# EAGLE design PSPS_AVNC_SRD_power-2020-09-19 (EAGLE 9.6.2)
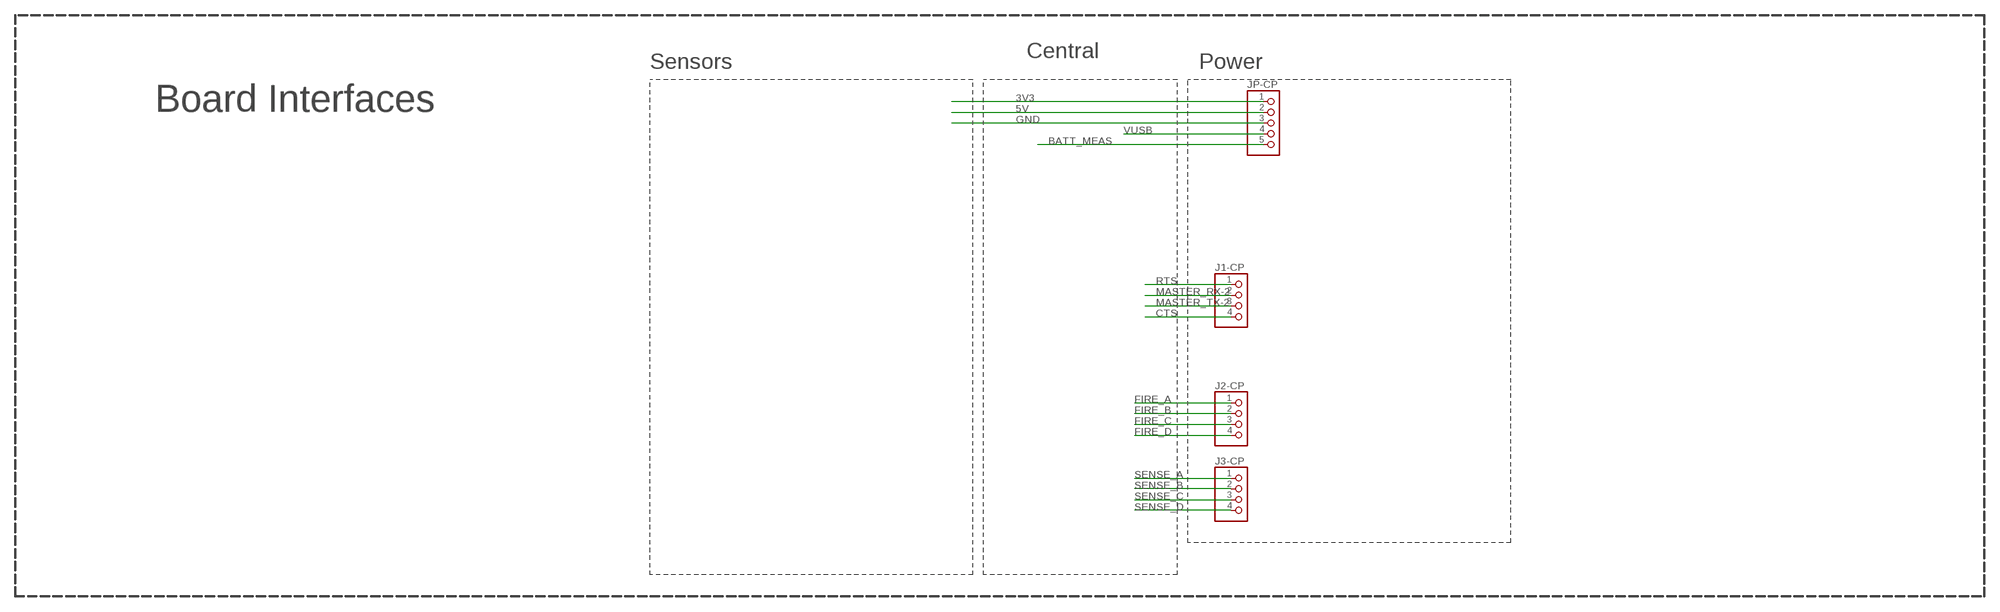
[diagram p0: schematic, sheet 1, part 1 of 3]
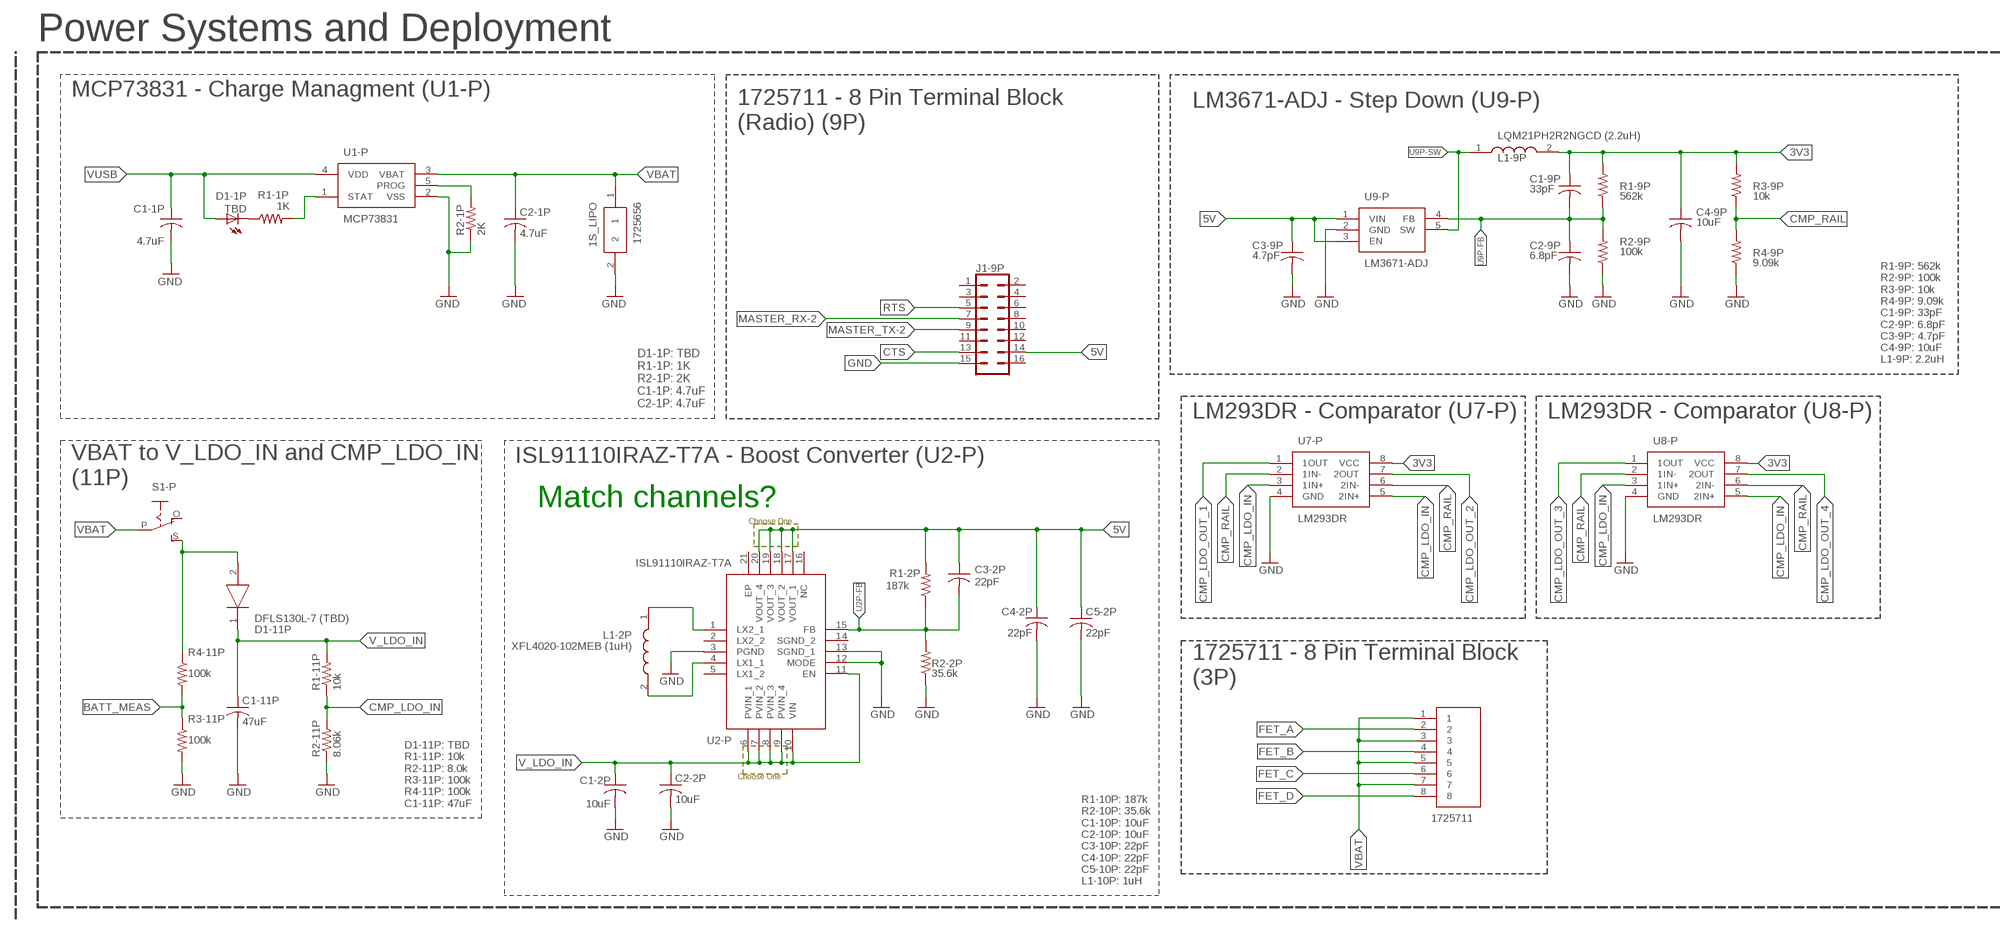
[diagram p1: schematic, sheet 1, part 2 of 3]
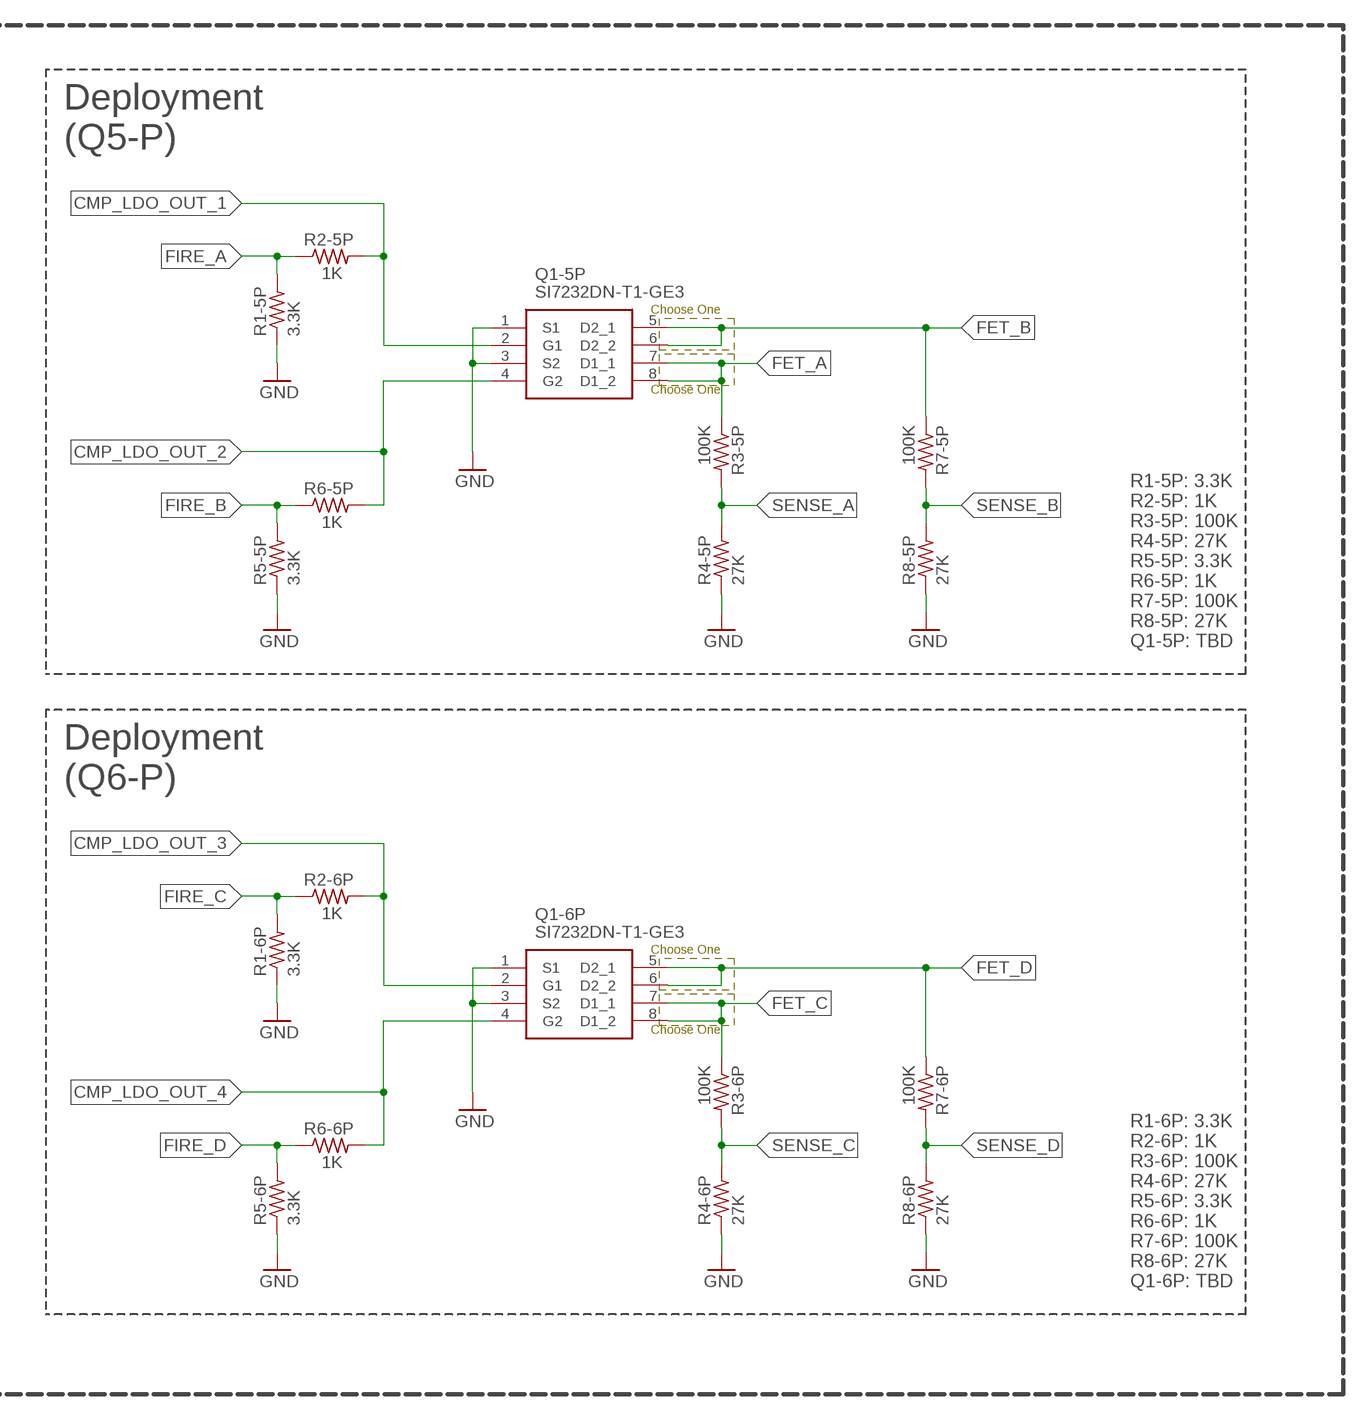
[diagram p2: schematic, sheet 1, part 3 of 3]

## Parts
1S_LIPO  1725656  [1725656]
C1-1P  4.7uF  C-USC0805  [C0805]
C1-2P  10uF  C-USC0805  [C0805]
C1-9P  33pF  C-USC0805  [C0805]
C1-11P  47uF  C-USC0805  [C0805]
C2-1P  4.7uF  C-USC0805  [C0805]
C2-2P  10uF  C-USC0805  [C0805]
C2-9P  6.8pF  C-USC0805  [C0805]
C3-2P  22pF  C-USC0805  [C0805]
C3-9P  4.7pF  C-USC0805  [C0805]
C4-2P  22pF  C-USC0805  [C0805]
C4-9P  10uF  C-USC0805  [C0805]
C5-2P  22pF  C-USC0805  [C0805]
D1-1P  TBD  LEDCHIPLED_0805  [CHIPLED_0805]
D1-11P  DFLS130L-7 (TBD)  DFLS130L-7  [POWERDI_123]
J1-9P  CONN_08X2  [2X8]
J1-CP  PINHD-1X4  [1X04]
J2-CP  PINHD-1X4  [1X04]
J2-P  1725711  [1725711]
J3-CP  PINHD-1X4  [1X04]
JP-CP  PINHD-1X5  [1X05]
L1-2P  XFL4020-102MEB (1uH)  XFL4020-102MEB  [XFL4020]
L1-9P  LQM21PH2R2NGCD (2.2uH)  LQM21PH2R2NGCD  [INDC2012X100N]
Q1-5P  SI7232DN-T1-GE3  [POWERPAK-1212-8]
Q1-6P  SI7232DN-T1-GE3  [POWERPAK-1212-8]
R1-1P  1K  R-US_R0805  [R0805]
R1-2P  187k  R-US_R0805  [R0805]
R1-5P  3.3K  R-US_M0805  [M0805]
R1-6P  3.3K  R-US_M0805  [M0805]
R1-9P  562k  R-US_R0805  [R0805]
R1-11P  10k  R-US_R0805  [R0805]
R2-1P  2K  R-US_R0805  [R0805]
R2-2P  35.6k  R-US_R0805  [R0805]
R2-5P  1K  R-US_M0805  [M0805]
R2-6P  1K  R-US_M0805  [M0805]
R2-9P  100k  R-US_R0805  [R0805]
R2-11P  8.06k  R-US_R0805  [R0805]
R3-5P  100K  R-US_M0805  [M0805]
R3-6P  100K  R-US_M0805  [M0805]
R3-9P  10k  R-US_R0805  [R0805]
R3-11P  100k  R-US_R0805  [R0805]
R4-5P  27K  R-US_M0805  [M0805]
R4-6P  27K  R-US_M0805  [M0805]
R4-9P  9.09k  R-US_R0805  [R0805]
R4-11P  100k  R-US_R0805  [R0805]
R5-5P  3.3K  R-US_M0805  [M0805]
R5-6P  3.3K  R-US_M0805  [M0805]
R6-5P  1K  R-US_M0805  [M0805]
R6-6P  1K  R-US_M0805  [M0805]
R7-5P  100K  R-US_M0805  [M0805]
R7-6P  100K  R-US_M0805  [M0805]
R8-5P  27K  R-US_M0805  [M0805]
R8-6P  27K  R-US_M0805  [M0805]
S1-P  EG1218S  [EG1218]
U1-P  MCP73831  MCP73831T-2ACI_OT  [SOT95P270X145-5N]
U2-P  ISL91110IRAZ-T7A  [QFN50P400X400X100-21N]
U7-P  LM293DR  [SOIC127P600X175-8N]
U8-P  LM293DR  [SOIC127P600X175-8N]
U9-P  LM3671-ADJ  LM3671MFX-ADJ_NOPB  [SOT95P280X145-5N]

## Nets
3V3: C1-9P.1 C4-9P.1 JP-CP.1 L1-9P.2 R1-9P.2 R3-9P.2 U7-P.8(VCC) U8-P.8(VCC)
5V: C3-2P.1 C3-9P.1 C4-2P.1 C5-2P.1 J1-9P.14 JP-CP.2 R1-2P.2 U2-P.17(VOUT_1) U2-P.18(VOUT_2) U2-P.19(VOUT_3) U2-P.20(VOUT_4) U9-P.1(VIN) U9-P.3(EN)
BATT_MEAS: JP-CP.5 R3-11P.1 R4-11P.2
CMP_LDO_IN: R1-11P.1 R2-11P.2 U7-P.3(1IN+) U7-P.5(2IN+) U8-P.3(1IN+) U8-P.5(2IN+)
CMP_LDO_OUT_1: Q1-5P.2(G1) R2-5P.2 U7-P.1(1OUT)
CMP_LDO_OUT_2: Q1-5P.4(G2) R6-5P.2 U7-P.7(2OUT)
CMP_LDO_OUT_3: Q1-6P.2(G1) R2-6P.2 U8-P.1(1OUT)
CMP_LDO_OUT_4: Q1-6P.4(G2) R6-6P.2 U8-P.7(2OUT)
CMP_RAIL: R3-9P.1 R4-9P.2 U7-P.2(1IN-) U7-P.6(2IN-) U8-P.2(1IN-) U8-P.6(2IN-)
CTS: J1-9P.13 J1-CP.4
D1-1P_R1-1P: D1-1P.C R1-1P.1
FET_A: J2-P.2 Q1-5P.7(D1_1) Q1-5P.8(D1_2) R3-5P.1
FET_B: J2-P.4 Q1-5P.5(D2_1) Q1-5P.6(D2_2) R7-5P.1
FET_C: J2-P.6 Q1-6P.7(D1_1) Q1-6P.8(D1_2) R3-6P.1
FET_D: J2-P.8 Q1-6P.5(D2_1) Q1-6P.6(D2_2) R7-6P.1
FIRE_A: J2-CP.1 R1-5P.2 R2-5P.1
FIRE_B: J2-CP.2 R5-5P.2 R6-5P.1
FIRE_C: J2-CP.3 R1-6P.2 R2-6P.1
FIRE_D: J2-CP.4 R5-6P.2 R6-6P.1
GND: 1S_LIPO.2 C1-1P.2 C1-2P.2 C1-11P.2 C2-1P.2 C2-2P.2 C2-9P.2 C3-9P.2 C4-2P.2 C4-9P.2 C5-2P.2 J1-9P.15 JP-CP.3 Q1-5P.1(S1) Q1-5P.3(S2) Q1-6P.1(S1) Q1-6P.3(S2) R1-5P.1 R1-6P.1 R2-1P.1 R2-2P.1 R2-9P.1 R2-11P.1 R3-11P.2 R4-5P.1 R4-6P.1 R4-9P.1 R5-5P.1 R5-6P.1 R8-5P.1 R8-6P.1 U1-P.2(VSS) U2-P.3(PGND) U2-P.12(MODE) U2-P.13(SGND_1) U7-P.4(GND) U8-P.4(GND) U9-P.2(GND)
MASTER_RX-2: J1-9P.7 J1-CP.2
MASTER_TX-2: J1-9P.9 J1-CP.3
RTS: J1-9P.5 J1-CP.1
SENSE_A: J3-CP.1 R3-5P.2 R4-5P.2
SENSE_B: J3-CP.2 R7-5P.2 R8-5P.2
SENSE_C: J3-CP.3 R3-6P.2 R4-6P.2
SENSE_D: J3-CP.4 R7-6P.2 R8-6P.2
U1P-PROG: R2-1P.2 U1-P.5(PROG)
U1P-STAT: R1-1P.2 U1-P.1(STAT)
U2P-FB: C3-2P.2 R1-2P.1 R2-2P.2 U2-P.15(FB)
U9P-FB: C1-9P.2 C2-9P.1 R1-9P.1 R2-9P.2 U9-P.4(FB)
U9P-LX1_1: L1-2P.2 U2-P.4(LX1_1)
U9P-LX2_1: L1-2P.1 U2-P.1(LX2_1)
U9P-SW: L1-9P.1 U9-P.5(SW)
V_LDO_IN: C1-2P.1 C1-11P.1 C2-2P.1 D1-11P.1(K) R1-11P.2 U2-P.6(PVIN_1) U2-P.7(PVIN_2) U2-P.8(PVIN_3) U2-P.9(PVIN_4) U2-P.10(VIN) U2-P.11(EN)
VBAT: 1S_LIPO.1 C2-1P.1 J2-P.1 J2-P.3 J2-P.5 J2-P.7 S1-P.P U1-P.3(VBAT)
VBAT_AFTER_SWITCH: D1-11P.2(A) R4-11P.1 S1-P.S
VUSB: C1-1P.1 D1-1P.A JP-CP.4 U1-P.4(VDD)
Unconnected: J1-9P.1 J1-9P.2 J1-9P.3 J1-9P.4 J1-9P.6 J1-9P.8 J1-9P.10 J1-9P.11 J1-9P.12 J1-9P.16 S1-P.O U2-P.2(LX2_2) U2-P.5(LX1_2) U2-P.14(SGND_2) U2-P.16(NC) U2-P.21(EP)

## Notes on the sheet
- Power Systems and Deployment
- MCP73831 - Charge Managment (U1-P)
- LM3671-ADJ - Step Down (U9-P)
- 1725711 - 8 Pin Terminal Block 
  (Radio) (9P)
- Deployment
  (Q5-P)
- Choose One
- Choose One
- R1-9P: 562k
  R2-9P: 100k
  R3-9P: 10k
  R4-9P: 9.09k
  C1-9P: 33pF
  C2-9P: 6.8pF
  C3-9P: 4.7pF
  C4-9P: 10uF
  L1-9P: 2.2uH
- D1-1P: TBD
  R1-1P: 1K
  R2-1P: 2K
  C1-1P: 4.7uF
  C2-1P: 4.7uF
- LM293DR - Comparator (U7-P) | LM293DR - Comparator (U8-P)
- R1-5P: 3.3K
  R2-5P: 1K
  R3-5P: 100K
  R4-5P: 27K
  R5-5P: 3.3K
  R6-5P: 1K
  R7-5P: 100K
  R8-5P: 27K
  Q1-5P: TBD
- ISL91110IRAZ-T7A - Boost Converter (U2-P)
- VBAT to V_LDO_IN and CMP_LDO_IN
  (11P)
- Match channels?
- Choose One
- Deployment
  (Q6-P)
- Choose One
- Choose One
- 1725711 - 8 Pin Terminal Block
  (3P)
- Choose One
- D1-11P: TBD
  R1-11P: 10k
  R2-11P: 8.0k
  R3-11P: 100k
  R4-11P: 100k
  C1-11P: 47uF
- R1-6P: 3.3K
  R2-6P: 1K
  R3-6P: 100K
  R4-6P: 27K
  R5-6P: 3.3K
  R6-6P: 1K
  R7-6P: 100K
  R8-6P: 27K
  Q1-6P: TBD
- R1-10P: 187k
  R2-10P: 35.6k
  C1-10P: 10uF
  C2-10P: 10uF
  C3-10P: 22pF
  C4-10P: 22pF
  C5-10P: 22pF
  L1-10P: 1uH
- Central
- Sensors | Power
- Board Interfaces

## Library data of the parts
1S_LIPO = SamacSys_Parts:1725656: 2 way PCB vertical mount terminal,2.54mm 2 way PCB vertical mount terminal,2.54mm Source: Datasheet <https://componentsearchengine.com/Datasheets/1/1725656.pdf>; DESCRIPTION: 2 way PCB vertical mount terminal,2.54mm 2 way PCB vertical mount terminal,2.54mm; HEIGHT: 8mm; MANUFACTURER_NAME: Phoenix Contact; MANUFACTURER_PART_NUMBER: 1725656; MOUSER_PART_NUMBER: 651-1725656; MOUSER_PRICE-STOCK: https://www.mouser.com/Search/Refine.aspx?Keyword=651-1725656
C1-1P C1-2P C1-9P C1-11P C2-1P C2-9P C3-2P C3-9P C4-9P = resistor:C-US: CAPACITOR, American symbol
C2-2P C5-2P = BeagleBone_Black_Wireless:C-US: CAPACITOR, American symbol
C4-2P = resistor:C-US: CAPACITOR, American symbol; SPICEPREFIX: C
D1-1P = adafruit:LED: LED OSRAM: - CHIPLED LG R971, LG N971, LY N971, LG Q971, LY Q971, LO R971, LY R971 LH N974, LH R974 LS Q976, LO Q976, LY Q976 LO Q996 - Hyper CHIPLED LW Q18S LB Q993, LB Q99A, LB R99A - SideLED LS A670, LO A670, LY A670, LG A670, LP A670 LB A673, LV A673, LT A673, LW A673 LH A674 LY A675 LS A676, LA A676, LO A676, LY A676, LW A676 LS A679, LY A679, LG A679 - Hyper Micro SIDELED® LS Y876, LA Y876, LO Y876, LY Y876 LT Y87S - SmartLED LW L88C, LW L88S LB L89C, LB L89S, LG L890 LS L89K, LO L89K, LY L89K LS L896, LA L896, LO L896, LY L896 - TOPLED LS T670, LO T670, LY T670, LG T670, LP T670 LSG T670, LSP T670, LSY T670, LOP T670, LYG T670 LG T671, LOG T671, LSG T671 LB T673, LV T673, LT T673, LW T673 LH T674 LS T676, LA T676, LO T676, LY T676, LB T676, LH T676, LSB T676, LW T676 LB T67C, LV T67C, LT T67C, LS T67K, LO T67K, LY T67K, LW E67C LS E67B, LA E67B, LO E67B, LY E67B, LB E67C, LV E67C, LT E67C LW T67C LS T679, LY T679, LG T679 LS T770, LO T770, LY T770, LG T770, LP T770 LB T773, LV T773, LT T773, LW T773 LH T774 LS E675, LA E675, LY E675, LS T675 LS T776, LA T776, LO T776, LY T776, LB T776 LHGB T686 LT T68C, LB T68C - Hyper Mini TOPLED® LB M676 - Mini TOPLED Santana® LG M470 LS M47K, LO M47K, LY M47K Source: http://www.osram.convergy.de/
D1-11P = SamacSys_Parts:DFLS130L-7: 1.0A SURFACE MOUNT SCHOTTKY BARRIER RECTIFIER Source: Datasheet <https://componentsearchengine.com/Datasheets/1/DFLS130L-7.pdf>; DESCRIPTION: 1.0A SURFACE MOUNT SCHOTTKY BARRIER RECTIFIER; HEIGHT: mm; MANUFACTURER_NAME: Diodes Inc.; MANUFACTURER_PART_NUMBER: DFLS130L-7; MOUSER_PART_NUMBER: 621-DFLS130L; MOUSER_PRICE-STOCK: https://www.mouser.com/Search/Refine.aspx?Keyword=621-DFLS130L
J1-9P = SparkFun-Connectors:CONN_08X2: Multi connection point. Often used as Generic Header-pin footprint for 0.1 inch spaced/style header connections You can populate with any combo of single row headers, but if you'd like an exact match, check this: Header - 2x8 (Male, 0.1") <https://www.sparkfun.com/products/13156> (PRT-13156) On any of the 0.1 inch spaced packages, you can populate with these: Break Away Headers - Straight <https://www.sparkfun.com/products/116> (PRT-00116) Break Away Male Headers - Right Angle <https://www.sparkfun.com/products/553> (PRT-00553) Female Headers <https://www.sparkfun.com/products/115> (PRT-00115) Break Away Headers - Machine Pin <https://www.sparkfun.com/products/117> (PRT-00117) Break Away Female Headers - Swiss Machine Pin <https://www.sparkfun.com/products/743> (PRT-00743)
J1-CP J2-CP J3-CP = pinhead:PINHD-1X4: PIN HEADER
J2-P = SamacSys_Parts:1725711: 8 way PCB vertical mount terminal,2.54mm 8 way PCB vertical mount terminal,2.54mm Source: Datasheet <https://componentsearchengine.com/Datasheets/1/1725711.pdf>; DESCRIPTION: 8 way PCB vertical mount terminal,2.54mm 8 way PCB vertical mount terminal,2.54mm; HEIGHT: mm; MANUFACTURER_NAME: Phoenix Contact; MANUFACTURER_PART_NUMBER: 1725711; MOUSER_PART_NUMBER: 651-1725711; MOUSER_PRICE-STOCK: https://www.mouser.com/Search/Refine.aspx?Keyword=651-1725711
JP-CP = pinhead:PINHD-1X5: PIN HEADER
L1-2P = SamacSys_Parts:XFL4020-102MEB: Fixed Inductors XFL4020 AEC-Q200 1 uH 20% 11 A Compos Source: Datasheet <https://componentsearchengine.com/Datasheets/1/XFL4020-102MEB.pdf>; DESCRIPTION: Fixed Inductors XFL4020 AEC-Q200 1 uH 20% 11 A Compos; HEIGHT: mm; MANUFACTURER_NAME: COILCRAFT; MANUFACTURER_PART_NUMBER: XFL4020-102MEB; MOUSER_PART_NUMBER: 994-XFL4020-102MEB; MOUSER_PRICE-STOCK: https://www.mouser.com/Search/Refine.aspx?Keyword=994-XFL4020-102MEB
L1-9P = SamacSys_Parts:LQM21PH2R2NGCD: LQM21PH_GC Series Inductor 2.2uH +/-30% 0805 (2012) Source: Datasheet <https://componentsearchengine.com/Datasheets/1/LQM21PH2R2NGCD.pdf>; DESCRIPTION: LQM21PH_GC Series Inductor 2.2uH +/-30% 0805 (2012); HEIGHT: 1mm; MANUFACTURER_NAME: Murata Electronics; MANUFACTURER_PART_NUMBER: LQM21PH2R2NGCD; MOUSER_PART_NUMBER: 81-LQM21PH2R2NGCD; MOUSER_PRICE-STOCK: https://www.mouser.com/Search/Refine.aspx?Keyword=81-LQM21PH2R2NGCD
Q1-5P Q1-6P = SamacSys_Parts:SI7232DN-T1-GE3: Trans MOSFET N-CH 20V 10An Vishay SI7232DN-T1-GE3 Dual N-channel MOSFET Transistor, 24 A, 20 V, 8-Pin PowerPAK 1212 Source: Datasheet <https://componentsearchengine.com/Datasheets/1/SI7232DN-T1-GE3.pdf>; DESCRIPTION: Trans MOSFET N-CH 20V 10An Vishay SI7232DN-T1-GE3 Dual N-channel MOSFET Transistor, 24 A, 20 V, 8-Pin PowerPAK 1212; HEIGHT: mm; MANUFACTURER_NAME: Vishay; MANUFACTURER_PART_NUMBER: SI7232DN-T1-GE3; MOUSER_PART_NUMBER: 781-SI7232DN-GE3; MOUSER_PRICE-STOCK: https://www.mouser.com/Search/Refine.aspx?Keyword=781-SI7232DN-GE3
R1-1P R1-2P R1-9P R1-11P R2-1P R2-2P R2-9P R2-11P R3-9P R4-9P = resistor:R-US_: RESISTOR, American symbol
R1-5P R1-6P R2-5P R2-6P R3-5P R3-6P R4-5P R4-6P R5-5P R5-6P R6-5P R6-6P R7-5P R7-6P R8-5P R8-6P = rcl:R-US_: RESISTOR, American symbol; SPICEPREFIX: R
R3-11P R4-11P = PulseOximeterECG_AU:R-US_: RESISTOR, American symbol; SPICEPREFIX: R
S1-P = adafruit:EG1218: SLIDING SWITCH 0.1" spacing through hole, vertical SPDT slide switch http://www.ladyada.net/library/pcb/eaglelibrary.html
U1-P = SamacSys_Parts:MCP73831T-2ACI_OT: Li-Ion Charge Controller 4.2V SOT23-5 Source: Datasheet <https://componentsearchengine.com/Datasheets/1/MCP73831T-2ACI_OT.pdf>; DESCRIPTION: Li-Ion Charge Controller 4.2V SOT23-5; HEIGHT: 1.45mm; MANUFACTURER_NAME: Microchip; MANUFACTURER_PART_NUMBER: MCP73831T-2ACI/OT; MOUSER_PART_NUMBER: 579-MCP73831T-2ACIOT; MOUSER_PRICE-STOCK: https://www.mouser.com/Search/Refine.aspx?Keyword=579-MCP73831T-2ACIOT
U2-P = SamacSys_Parts:ISL91110IRAZ-T7A: Integrated FET Regulators High Current Buck Boost Switching Regulator Delivering 2A of Continuous Output Current Source: Datasheet <https://www.renesas.com/en-us/www/doc/datasheet/isl91110ir.pdf>; DESCRIPTION: Integrated FET Regulators High Current Buck Boost Switching Regulator Delivering 2A of Continuous Output Current; HEIGHT: 1mm; MANUFACTURER_NAME: Renesas Electronics; MANUFACTURER_PART_NUMBER: ISL91110IRAZ-T7A
U7-P U8-P = SamacSys_Parts:LM293DR: Dual differential comparator, industrial grade Source: Datasheet <http://www.ti.com/lit/gpn/lm293>; DESCRIPTION: Dual differential comparator, industrial grade; HEIGHT: 1.75mm; MANUFACTURER_NAME: Texas Instruments; MANUFACTURER_PART_NUMBER: LM293DR; MOUSER_PART_NUMBER: 595-LM293DR; MOUSER_PRICE-STOCK: https://www.mouser.com/Search/Refine.aspx?Keyword=595-LM293DR
U9-P = SamacSys_Parts:LM3671MFX-ADJ_NOPB: 2MHz, 600mA Step-Down DC-DC Converter Source: Datasheet <http://www.ti.com/lit/gpn/lm3671>; DESCRIPTION: 2MHz, 600mA Step-Down DC-DC Converter; HEIGHT: 1.45mm; MANUFACTURER_NAME: Texas Instruments; MANUFACTURER_PART_NUMBER: LM3671MFX-ADJ/NOPB; MOUSER_PART_NUMBER: 926-LM3671MFXADJNOPB; MOUSER_PRICE-STOCK: https://www.mouser.com/Search/Refine.aspx?Keyword=926-LM3671MFXADJNOPB

## Board
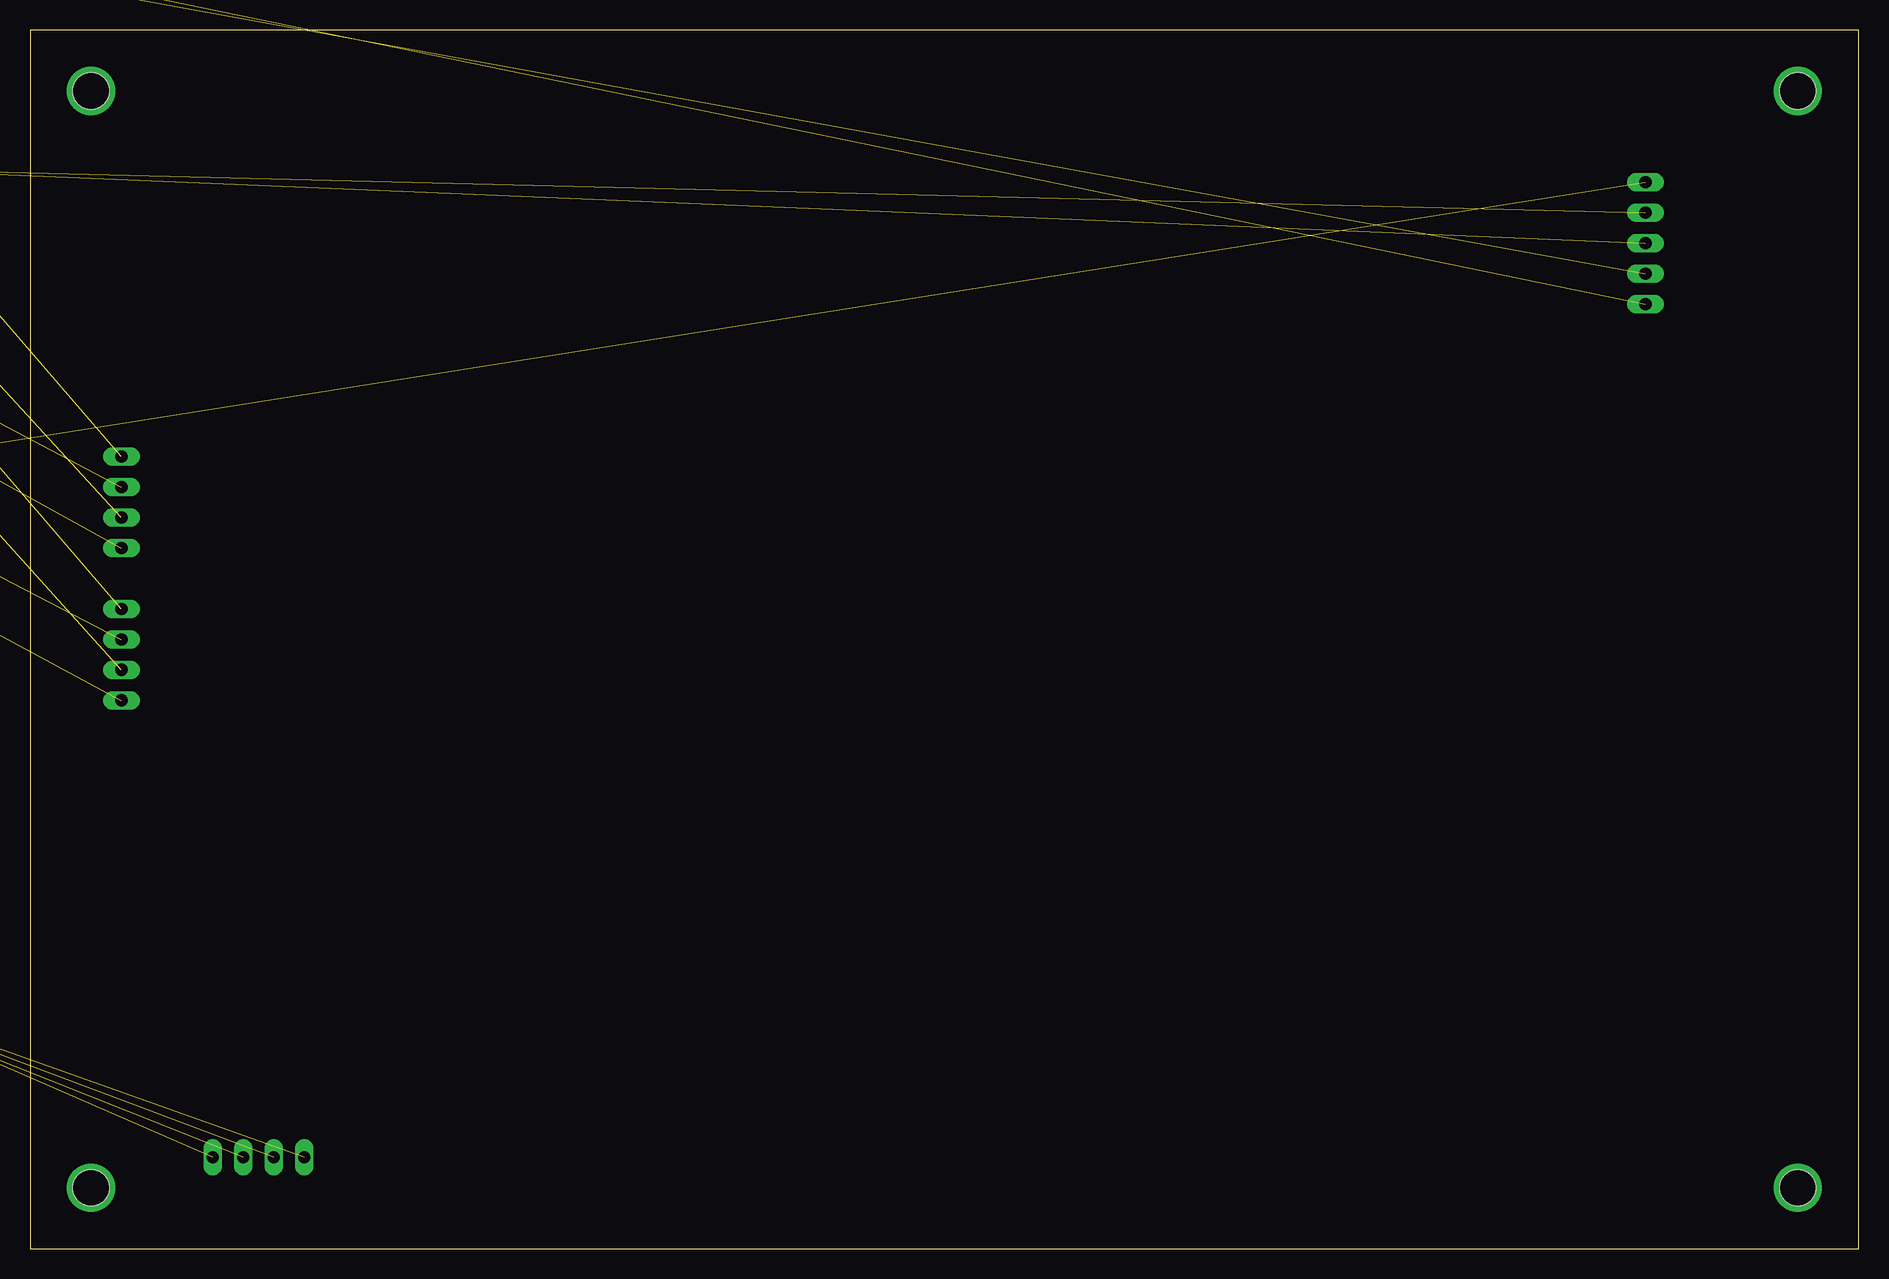
[diagram p3: board, top side]
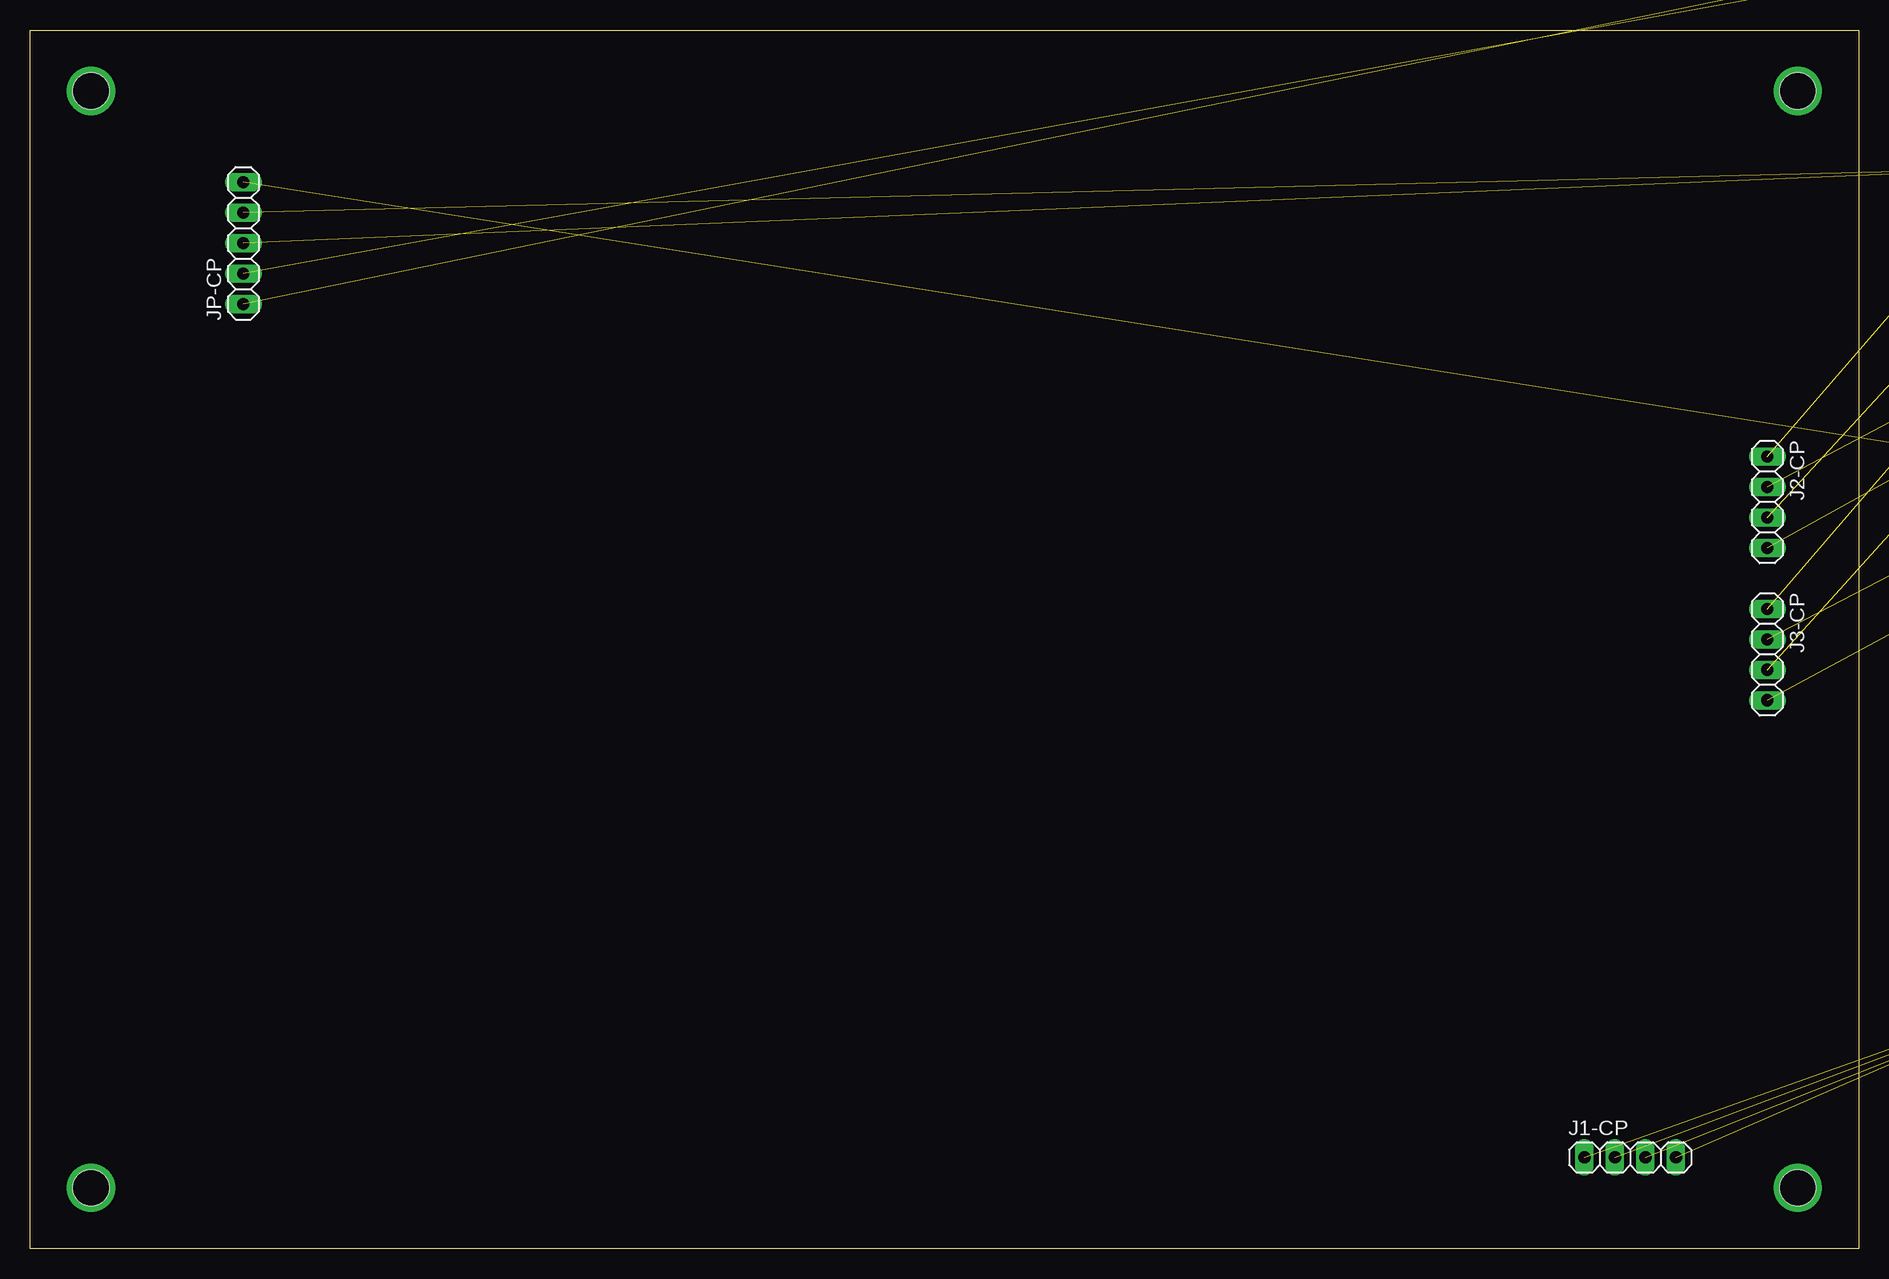
[diagram p4: board, bottom side, seen from below]

Size 152.4 x 101.6 mm. Coordinates in mm from the lower left corner, seen from the top.
Outline: 0,0 152.4,0 152.4,101.6 0,101.6 0,0
Copper layers (1*16): Top 0.035mm / dielectric 1.5mm / Bottom 0.035mm
Design rules "default": minimum track width 6mil, minimum drill 0.35mm, track to track 6mil, track to pad 6mil, pad to pad 6mil, via to via 6mil, smd to smd 6mil, copper to edge 40mil, drill to drill 6mil, minimum pad ring 10mil, minimum via ring 8mil, stop-mask expansion 4mil, vias tented up to drill 0mil, thermal gap 10mil
Holes 3 mm at 5.08,96.52 147.32,96.52 147.32,5.08 5.08,5.08

### Footprints (pad centres in the part's own frame; a part is rotated, then mirrored left to right if it is on the bottom)
1725656 = drill 1.1 pad 1.65: 1 -1.27,3.1; 2 1.27,3.1 | hole 1.1: -1.27,0.56; 1.27,0.56
C0805 = smd 1.3 x 1.5: 1 -0.95,0; 2 0.95,0
C0805' = smd 1.3 x 1.5: 1 -0.85,0; 2 0.85,0
CHIPLED_0805 = smd 1.2 x 1.2: A 0,-1.05; C 0,1.05
POWERDI_123 = smd 2.2 x 1.4: 1 -1.6,0 | smd 0.9 x 1.4: 2 0.95,0
2X8 = drill 1.016 pad 1.88: 1 0,0; 2 0,2.54; 3 2.54,0; 4 2.54,2.54; 5 5.08,0; 6 5.08,2.54; 7 7.62,0; 8 7.62,2.54; 9 10.16,0; 10 10.16,2.54; 11 12.7,0; 12 12.7,2.54; 13 15.24,0; 14 15.24,2.54; 15 17.78,0; 16 17.78,2.54
1X04 = drill 1.016 long: 1 -3.81,0; 2 -1.27,0; 3 1.27,0; 4 3.81,0
1725711 = drill 1.1 pad 1.65: 1 -8.89,0; 2 -6.35,0; 3 -3.81,0; 4 -1.27,0; 5 1.27,0; 6 3.81,0; 7 6.35,0; 8 8.89,0
1X05 = drill 1.016 long: 1 -5.08,0; 2 -2.54,0; 3 0,0; 4 2.54,0; 5 5.08,0
XFL4020 = smd 0.98 x 3.4: 1 -1.185,0; 2 1.185,0
INDC2012X100N = smd 1.1 x 1.45: 1 -0.9,0; 2 0.9,0
POWERPAK-1212-8 = smd 0.99 x 0.405: 1 -1.435,0.99; 2 -1.435,0.33; 3 -1.435,-0.33; 4 -1.435,-0.99; 5 1.435,-0.99; 6 1.435,-0.33; 7 1.435,0.33; 8 1.435,0.99 | smd 1.725 x 2.235: 9 0.557,0
R0805 = smd 1.3 x 1.5: 1 -0.95,0; 2 0.95,0
M0805 = smd 1.3 x 1.6: 1 -0.95,0; 2 0.95,0
EG1218 = drill 0.9 pad 1.676: O -2.54,0; P 0,0; S 2.54,0
SOT95P270X145-5N = smd 1.4 x 0.6: 1 -1.25,0.95; 2 -1.25,0; 3 -1.25,-0.95; 4 1.25,-0.95; 5 1.25,0.95
QFN50P400X400X100-21N = smd 0.75 x 0.3: 1 -2,1; 2 -2,0.5; 3 -2,0; 4 -2,-0.5; 5 -2,-1; 11 2,-1; 12 2,-0.5; 13 2,0; 14 2,0.5; 15 2,1 | smd 0.3 x 0.75: 6 -1,-2; 7 -0.5,-2; 8 0,-2; 9 0.5,-2; 10 1,-2; 16 1,2; 17 0.5,2; 18 0,2; 19 -0.5,2; 20 -1,2 | smd 2.85 x 2.85: 21 0,0
SOIC127P600X175-8N = smd 1.525 x 0.65: 1 -2.712,1.905; 2 -2.712,0.635; 3 -2.712,-0.635; 4 -2.712,-1.905; 5 2.712,-1.905; 6 2.712,-0.635; 7 2.712,0.635; 8 2.712,1.905
SOT95P280X145-5N = smd 1.2 x 0.6: 1 -1.25,0.95; 2 -1.25,0; 3 -1.25,-0.95; 4 1.25,-0.95; 5 1.25,0.95

### Placement (x,y rotation side)
1S_LIPO  -80.01,26.67 0 top  (outside the outline)
C1-1P  -17.78,90.17 0 top  (outside the outline)
C1-2P  -30.48,90.17 0 top  (outside the outline)
C1-9P  -43.18,90.17 0 top  (outside the outline)
C1-11P  -80.01,64.77 0 top  (outside the outline)
C2-1P  -55.88,90.17 0 top  (outside the outline)
C2-2P  10uF  [C0805']  -116.84,102.87 0 top  (outside the outline)
C2-9P  -74.93,90.17 0 top  (outside the outline)
C3-2P  -87.63,90.17 0 top  (outside the outline)
C3-9P  -93.98,90.17 0 top  (outside the outline)
C4-2P  -100.33,90.17 0 top  (outside the outline)
C4-9P  -106.68,90.17 0 top  (outside the outline)
C5-2P  22pF  [C0805']  -17.78,109.22 0 top  (outside the outline)
D1-1P  -50.8,101.6 0 top  (outside the outline)
D1-11P  -97.79,119.38 0 top  (outside the outline)
J1-9P  -78.74,41.91 0 top  (outside the outline)
J1-CP  19.05,7.62 0 bottom
J2-CP  7.62,62.23 270 bottom
J2-P  -49.53,50.8 0 top  (outside the outline)
J3-CP  7.62,49.53 270 bottom
JP-CP  134.62,83.82 90 bottom
L1-2P  -93.98,114.3 0 top  (outside the outline)
L1-9P  -25.4,124.46 0 top  (outside the outline)
Q1-5P  -63.5,120.65 0 top  (outside the outline)
Q1-6P  -80.01,120.65 0 top  (outside the outline)
R1-1P  -55.88,71.12 0 top  (outside the outline)
R1-2P  -71.12,71.12 0 top  (outside the outline)
R1-5P  -113.03,90.17 0 top  (outside the outline)
R1-6P  -119.38,90.17 0 top  (outside the outline)
R1-9P  -101.6,71.12 0 top  (outside the outline)
R1-11P  -39.37,58.42 0 top  (outside the outline)
R2-1P  -109.22,71.12 0 top  (outside the outline)
R2-2P  -17.78,77.47 0 top  (outside the outline)
R2-5P  -17.78,96.52 0 top  (outside the outline)
R2-6P  -24.13,96.52 0 top  (outside the outline)
R2-9P  -48.26,77.47 0 top  (outside the outline)
R2-11P  -48.26,58.42 0 top  (outside the outline)
R3-5P  -30.48,96.52 0 top  (outside the outline)
R3-6P  -36.83,96.52 0 top  (outside the outline)
R3-9P  -71.12,77.47 0 top  (outside the outline)
R3-11P  -57.15,58.42 0 top  (outside the outline)
R4-5P  -43.18,96.52 0 top  (outside the outline)
R4-6P  -49.53,96.52 0 top  (outside the outline)
R4-9P  -78.74,77.47 0 top  (outside the outline)
R4-11P  -66.04,58.42 0 top  (outside the outline)
R5-5P  -55.88,96.52 0 top  (outside the outline)
R5-6P  -62.23,96.52 0 top  (outside the outline)
R6-5P  -68.58,96.52 0 top  (outside the outline)
R6-6P  -74.93,96.52 0 top  (outside the outline)
R7-5P  -81.28,96.52 0 top  (outside the outline)
R7-6P  -87.63,96.52 0 top  (outside the outline)
R8-5P  -93.98,96.52 0 top  (outside the outline)
R8-6P  -100.33,96.52 0 top  (outside the outline)
S1-P  -26.67,50.8 0 top  (outside the outline)
U1-P  -38.1,120.65 0 top  (outside the outline)
U2-P  -62.23,115.57 0 top  (outside the outline)
U7-P  -25.4,109.22 0 top  (outside the outline)
U8-P  -35.56,109.22 0 top  (outside the outline)
U9-P  -49.53,120.65 0 top  (outside the outline)

### Tracks (layer width: path | path; a pad name or v marks a point on that pad's centre or on a via)
3V3  (7 unrouted)
5V  (12 unrouted)
BATT_MEAS  (2 unrouted)
CMP_LDO_IN  (5 unrouted)
CMP_LDO_OUT_1  (2 unrouted)
CMP_LDO_OUT_2  (2 unrouted)
CMP_LDO_OUT_3  (2 unrouted)
CMP_LDO_OUT_4  (2 unrouted)
CMP_RAIL  (5 unrouted)
CTS  (1 unrouted)
D1-1P_R1-1P  (1 unrouted)
FET_A  (3 unrouted)
FET_B  (3 unrouted)
FET_C  (3 unrouted)
FET_D  (3 unrouted)
FIRE_A  (2 unrouted)
FIRE_B  (2 unrouted)
FIRE_C  (2 unrouted)
FIRE_D  (2 unrouted)
GND  (37 unrouted)
MASTER_RX-2  (1 unrouted)
MASTER_TX-2  (1 unrouted)
N$1  (via drill 3 pad 4)
  other vias: 5.08,5.08
N$3  (via drill 3 pad 4)
  other vias: 5.08,96.52
N$4  (via drill 3 pad 4)
  other vias: 147.32,96.52
N$5  (via drill 3 pad 4)
  other vias: 147.32,5.08
RTS  (1 unrouted)
SENSE_A  (2 unrouted)
SENSE_B  (2 unrouted)
SENSE_C  (2 unrouted)
SENSE_D  (2 unrouted)
U1P-PROG  (1 unrouted)
U1P-STAT  (1 unrouted)
U2P-FB  (3 unrouted)
U9P-FB  (4 unrouted)
U9P-LX1_1  (1 unrouted)
U9P-LX2_1  (1 unrouted)
U9P-SW  (1 unrouted)
V_LDO_IN  (10 unrouted)
VBAT  (7 unrouted)
VBAT_AFTER_SWITCH  (2 unrouted)
VUSB  (3 unrouted)